# EasyEDA Pro project BLDC Motor Controller PCB.eprj

# Schematic Schematic1
Board Name: Board1; Create Date: 2024-09-17
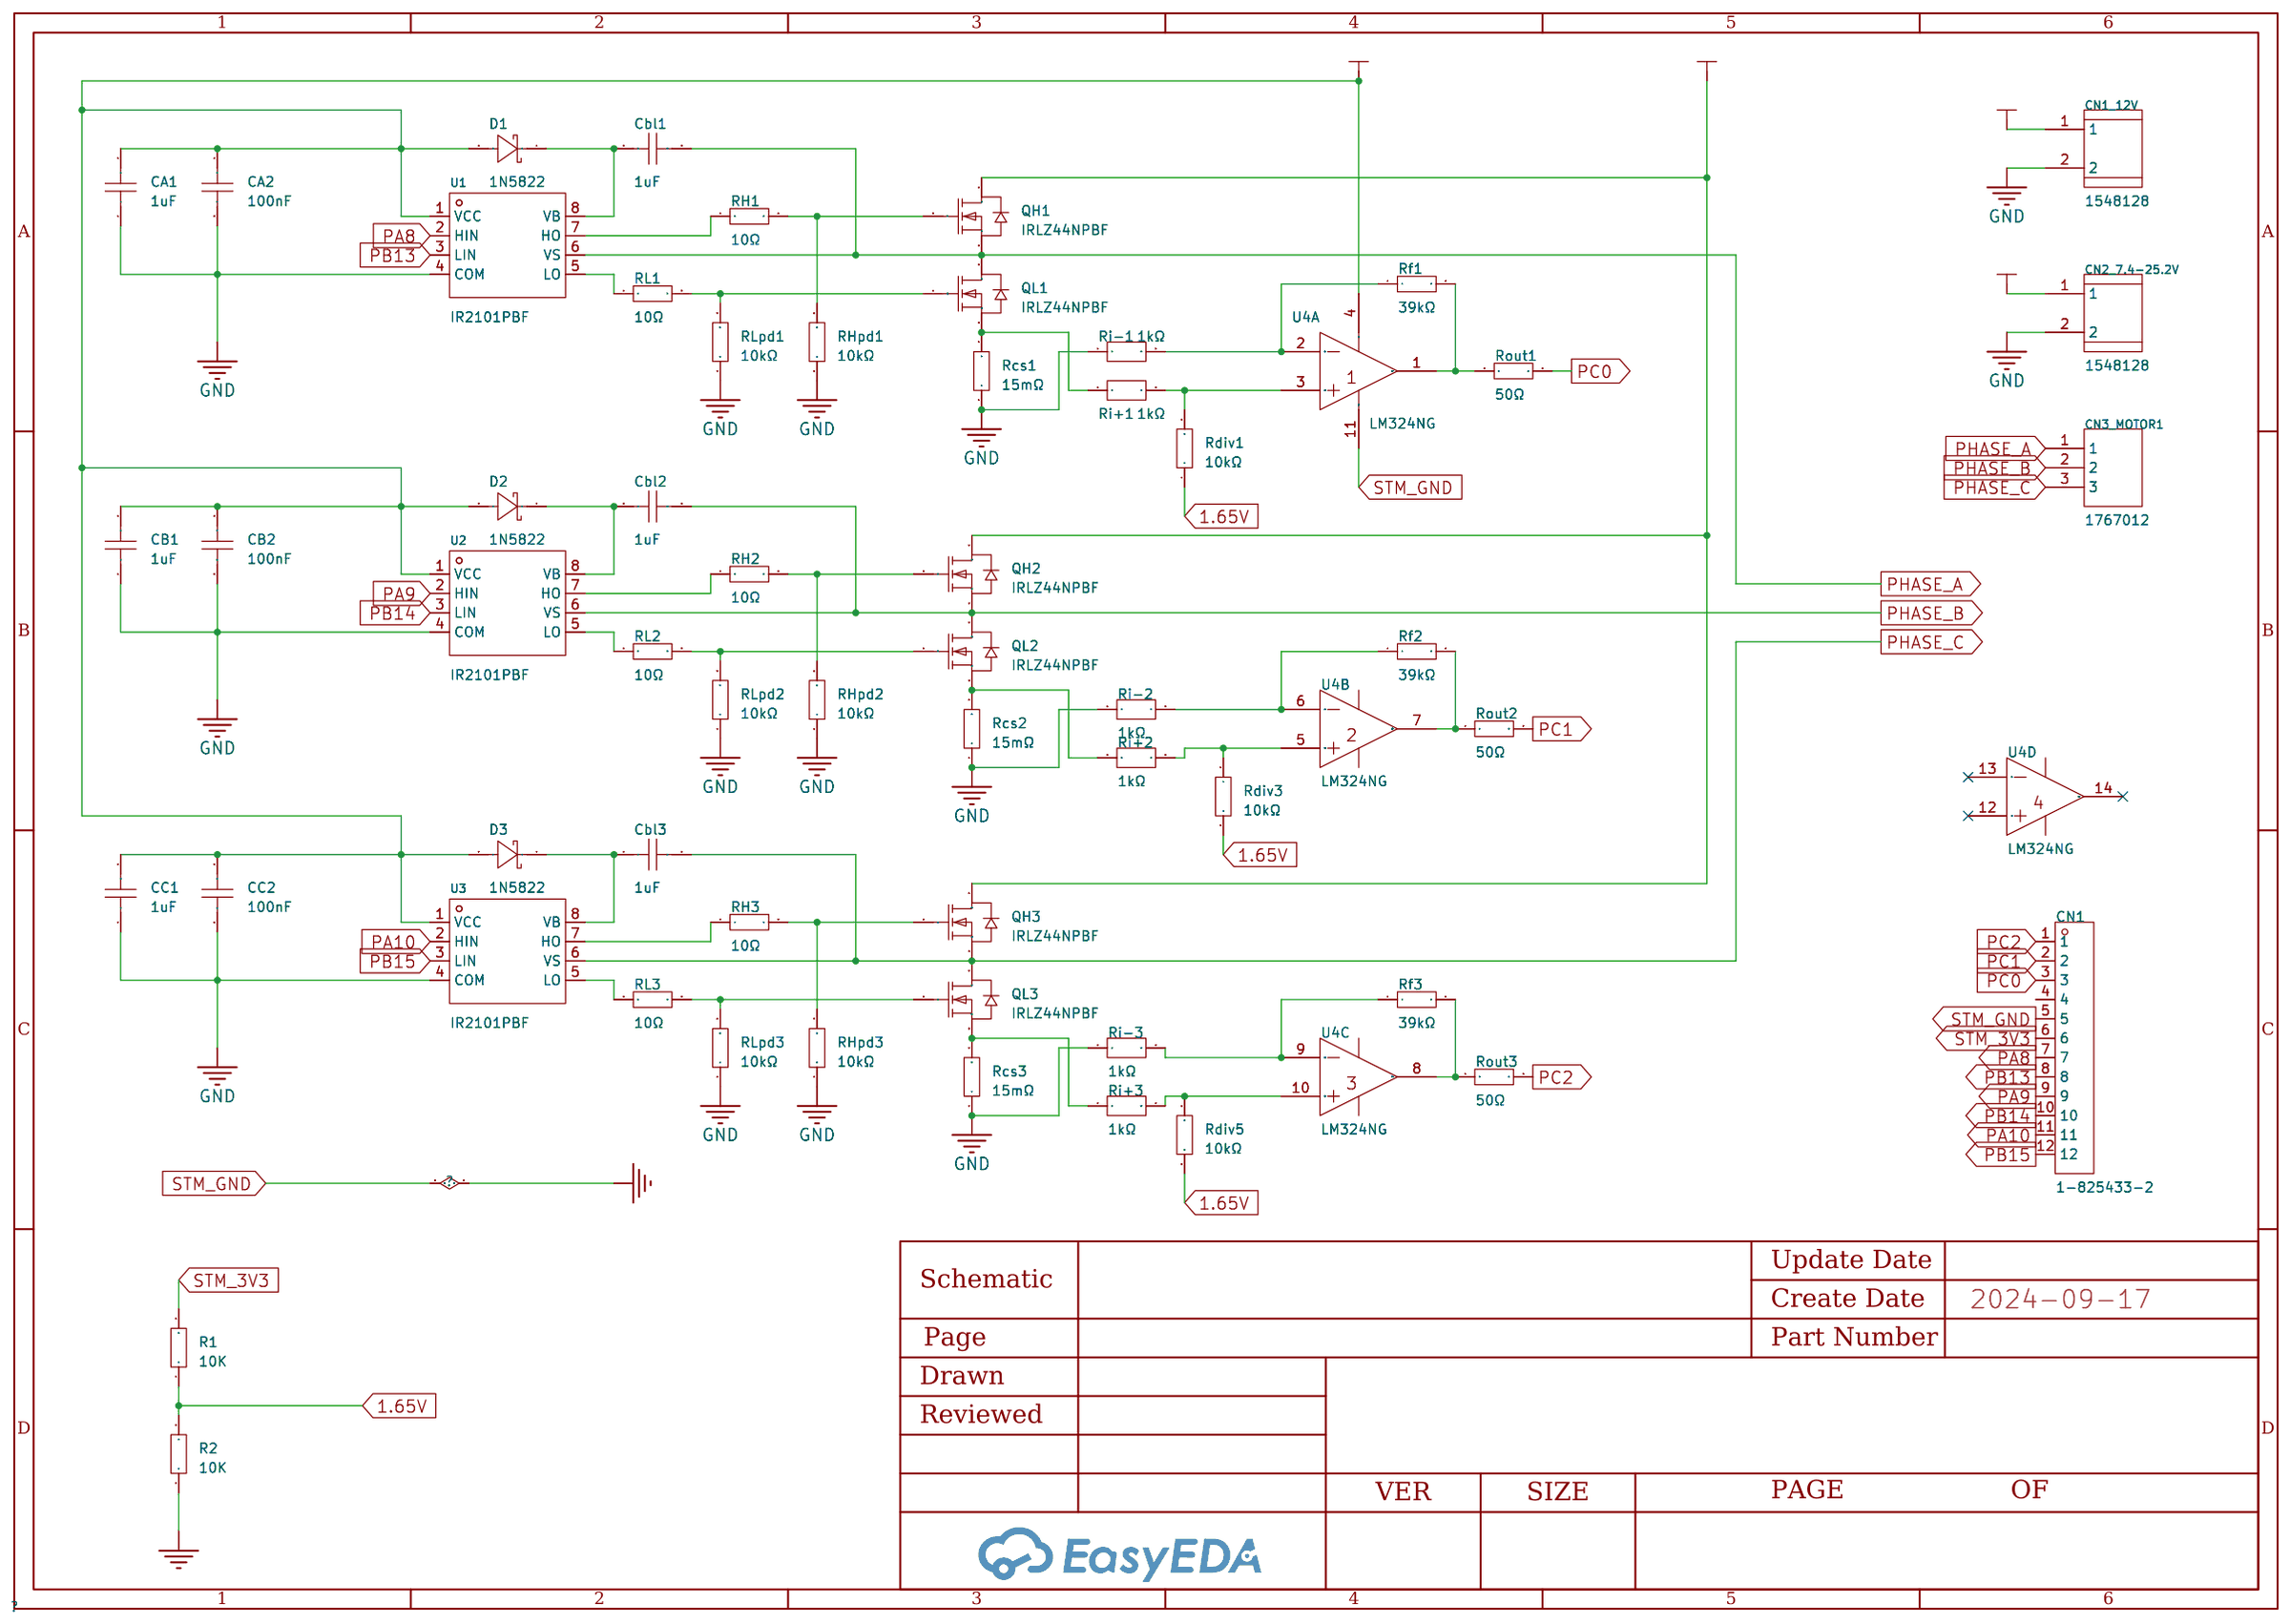
[diagram p0: schematic sheet]

## Parts
CA1  1uF  [CAP-TH_BD2.5-L6.6-P9.00-D0.50]
CA2  100nF  [CAP-TH_L3.8-W2.5-P5.08-D0.50]
CB1  1uF  [CAP-TH_BD2.5-L6.6-P9.00-D0.50]
CB2  100nF  [CAP-TH_L3.8-W2.5-P5.08-D0.50]
Cbl1  1uF  [CAP-TH_BD2.5-L6.6-P9.00-D0.50]
Cbl2  1uF  [CAP-TH_BD2.5-L6.6-P9.00-D0.50]
Cbl3  1uF  [CAP-TH_BD2.5-L6.6-P9.00-D0.50]
CC1  1uF  [CAP-TH_BD2.5-L6.6-P9.00-D0.50]
CC2  100nF  [CAP-TH_L3.8-W2.5-P5.08-D0.50]
CN1  1-825433-2  [HDR-TH_12P-P2.54-V-M]
CN1_12V  1548128  [CONN-TH_2P-P5.08_1733570]
CN2_7.4-25.2V  1548128  [CONN-TH_2P-P5.08_1733570]
CN3_MOTOR1  1767012  [CONN-TH_3P-P7.62_1717732]
D1  1N5822  [DO-201AD_BD5.3-L9.5-P13.50-D1.4-RD]
D2  1N5822  [DO-201AD_BD5.3-L9.5-P13.50-D1.4-RD]
D3  1N5822  [DO-201AD_BD5.3-L9.5-P13.50-D1.4-RD]
QH1  IRLZ44NPBF  [TO-220-3_L10.0-W4.5-P2.54-T]
QH2  IRLZ44NPBF  [TO-220-3_L10.0-W4.5-P2.54-T]
QH3  IRLZ44NPBF  [TO-220-3_L10.0-W4.5-P2.54-T]
QL1  IRLZ44NPBF  [TO-220-3_L10.0-W4.5-P2.54-T]
QL2  IRLZ44NPBF  [TO-220-3_L10.0-W4.5-P2.54-T]
QL3  IRLZ44NPBF  [TO-220-3_L10.0-W4.5-P2.54-T]
R1  10K  [R0603]
R2  10K  [R0603]
Rcs1  15mΩ  [R1206]
Rcs2  15mΩ  [R1206]
Rcs3  15mΩ  [R1206]
Rdiv1  10kΩ  [RES-TH_BD2.2-L6.5-P10.50-D0.6]
Rdiv3  10kΩ  [RES-TH_BD2.2-L6.5-P10.50-D0.6]
Rdiv5  10kΩ  [RES-TH_BD2.2-L6.5-P10.50-D0.6]
Rf1  39kΩ  [RES-TH_BD2.2-L6.5-P10.50-D0.6]
Rf2  39kΩ  [RES-TH_BD2.2-L6.5-P10.50-D0.6]
Rf3  39kΩ  [RES-TH_BD2.2-L6.5-P10.50-D0.6]
RH1  10Ω  [RES-TH_BD2.2-L6.5-P10.50-D0.6]
RH2  10Ω  [RES-TH_BD2.2-L6.5-P10.50-D0.6]
RH3  10Ω  [RES-TH_BD2.2-L6.5-P10.50-D0.6]
RHpd1  10kΩ  [RES-TH_BD2.2-L6.5-P10.50-D0.6]
RHpd2  10kΩ  [RES-TH_BD2.2-L6.5-P10.50-D0.6]
RHpd3  10kΩ  [RES-TH_BD2.2-L6.5-P10.50-D0.6]
Ri+1  1kΩ  [RES-TH_BD2.4-L6.3-P10.30-D0.6]
Ri+2  1kΩ  [RES-TH_BD2.4-L6.3-P10.30-D0.6]
Ri+3  1kΩ  [RES-TH_BD2.4-L6.3-P10.30-D0.6]
Ri-1  1kΩ  [RES-TH_BD2.4-L6.3-P10.30-D0.6]
Ri-2  1kΩ  [RES-TH_BD2.4-L6.3-P10.30-D0.6]
Ri-3  1kΩ  [RES-TH_BD2.4-L6.3-P10.30-D0.6]
RL1  10Ω  [RES-TH_BD2.2-L6.5-P10.50-D0.6]
RL2  10Ω  [RES-TH_BD2.2-L6.5-P10.50-D0.6]
RL3  10Ω  [RES-TH_BD2.2-L6.5-P10.50-D0.6]
RLpd1  10kΩ  [RES-TH_BD2.2-L6.5-P10.50-D0.6]
RLpd2  10kΩ  [RES-TH_BD2.2-L6.5-P10.50-D0.6]
RLpd3  10kΩ  [RES-TH_BD2.2-L6.5-P10.50-D0.6]
Rout1  50Ω  [RES-TH_BD2.2-L6.5-P10.50-D0.6]
Rout2  50Ω  [RES-TH_BD2.2-L6.5-P10.50-D0.6]
Rout3  50Ω  [RES-TH_BD2.2-L6.5-P10.50-D0.6]
U1  IR2101PBF  [DIP-8_L9.9-W6.6-P2.54-LS7.62-BL]
U2  IR2101PBF  [DIP-8_L9.9-W6.6-P2.54-LS7.62-BL]
U3  IR2101PBF  [DIP-8_L9.9-W6.6-P2.54-LS7.62-BL]
U4  LM324NG  [PDIP-14_L19.7-W6.6-P2.54-LS8.3-BL]  (sections 1,2,3,4)

## Library data of the parts
CA1 CB1 Cbl1-Cbl3 CC1 = SA205C303JAR: Capacitance:0.03uF Tolerance:±5% Tolerance:±5% Voltage Rated: Temperature Coefficient:; LCSC Part Name: 30nF ±5% 50V; Supplier Part: C2281278; Manufacturer: Kyocera AVX; Supplier Footprint: 插件,D2.5xL6.6mm; JLCPCB Part Class: Extended Part; Datasheet: https://atta.szlcsc.com/upload/public/pdf/source/20221018/3D1EC8610533FE1C26161EB1B75339DB.pdf; Supplier: LCSC; Tolerance: ±5%
CA2 CB2 CC2 = A104K15X7RF5UAA: Capacitance:0.1uF Tolerance:±10% Tolerance:±10% Voltage Rated: Temperature Coefficient:; LCSC Part Name: 100nF ±10% 50V; Supplier Part: C1620057; Manufacturer: VISHAY(威世); Supplier Footprint: 插件,D2.5xL3.8mm; JLCPCB Part Class: Extended Part; Datasheet: https://atta.szlcsc.com/upload/public/pdf/source/20210630/2D198A6344B58DDF852CFB19135430C4.pdf; Supplier: LCSC; Tolerance: ±10%
CN1 = HB-PH3-254112PB2GOP: Pin Structure:1x12P Pitch:2.54mm Row Spacing:2.54mm Circluar Pins/Square Pins:Square Pins Mounting Type:Straight Number of Rows:Plugin Number of Pins:12P Current Rating (Max):3A Voltage Rating (Max):250V Length of Mating Pin:6mm Insulation Height:2.54mm L; LCSC Part Name: 间距:2.54mm 1x12P 直插 方针; Supplier Part: C6332195; Manufacturer: HANBO(汉博); Supplier Footprint: 插件,P=2.54mm; JLCPCB Part Class: Extended Part; Datasheet: https://atta.szlcsc.com/upload/public/pdf/source/20230803/F72D259687963761DF1B552F3BB84A31.pdf; Supplier: LCSC; Pin Structure: 1x12P; Pitch: 2.54mm; Row Spacing: 2.54mm; Circluar Pins/Square Pins: Square Pins; Mounting Type: Straight; Number of Rows: Plugin; Number of Pins: 12P; Current Rating (Max): 3A; Voltage Rating (Max): 250V; Length of Mating Pin: 6mm; Insulation Height: 2.54mm; Length of End Connection Pin: 3mm; Contact Plating: Gold; Operating Temperature Range: -40℃~+105℃; Soldering Temperature(Max): 260℃; Color: Black
CN1_12V CN2_7.4-25.2V = 1733570: Structure:1x2P Pitch:5.08mm Color:Green Mounting Style:Straight Current Rating (Max):17.5A Voltage Rating (Max):400V Number of Pins:2P Number of Rows:1 Wire Gauge - AWG:14~30 Wire Gauge - AWG:14~30 Number of PINs Per Row:2 Operating Temperature Range:- Op; LCSC Part Name: 5.08mm 1x2P 排数:1 每排P数:2 直插; Supplier Part: C92150; Manufacturer: Phoenix Contact(菲尼克斯); Supplier Footprint: 插件,P=5.08mm; JLCPCB Part Class: Extended Part; Datasheet: https://atta.szlcsc.com/upload/public/pdf/source/20170105/1483610785418.pdf; Supplier: LCSC; Structure: 1x2P; Pitch: 5.08mm; Color: Green; Mounting Style: Straight; Current Rating (Max): 17.5A; Voltage Rating (Max): 400V; Number of Pins: 2P; Number of Rows: 1; Wire Gauge - AWG: 14~30; Number of PINs Per Row: 2
CN3_MOTOR1 = 1717732: Structure:1x3P Pitch:7.62mm Color:Green Mounting Style:Straight Current Rating (Max):17.5A Voltage Rating (Max):630V Number of Pins:3P Number of Rows:1 Wire Gauge - AWG:14~30 Wire Gauge - AWG:14~30 Number of PINs Per Row:3 Operating Temperature Range:- Op; LCSC Part Name: 7.62mm 1x3P 排数:1 每排P数:3 直插; Supplier Part: C90080; Manufacturer: Phoenix Contact(菲尼克斯); Supplier Footprint: 插件,P=7.62mm; JLCPCB Part Class: Extended Part; Datasheet: https://atta.szlcsc.com/upload/public/pdf/source/20161209/1481271801347.pdf; Supplier: LCSC; Structure: 1x3P; Pitch: 7.62mm; Color: Green; Mounting Style: Straight; Current Rating (Max): 17.5A; Voltage Rating (Max): 630V; Number of Pins: 3P; Number of Rows: 1; Wire Gauge - AWG: 14~30; Number of PINs Per Row: 3
D1-D3 = 1N5822_C915962: Diode Configuration:- Forward Voltage (Vf@If):525mV@3A Reverse Voltage (Vr):40V Average Rectified Current (Io):3A Reverse Leakage Current (Ir):2mA@40V; LCSC Part Name: 电压:40V 电流:3A; Supplier Part: C915962; Manufacturer: ST(意法半导体); Supplier Footprint: DO-201AD; JLCPCB Part Class: Extended Part; Datasheet: https://atta.szlcsc.com/upload/public/pdf/source/20210820/95C5062786EAC70E2238E3EBE6005F95.pdf; Supplier: LCSC; Forward Voltage (Vf@If): 525mV@3A; Reverse Voltage (Vr): 40V; Average Rectified Current (Io): 3A; Reverse Leakage Current (Ir): 2mA@40V
QH1-QH3 QL1-QL3 = IRLZ44NPBF: Type:1个NChannel Drain Source Voltage (Vdss): Continuous Drain Current (Id): Power Dissipation (Pd):； Drain Source On Resistance (RDS(on)@Vgs,Id):22mΩ@10V,25A Gate Threshold Voltage (Vgs(th)@Id):2V@250uA Total Gate Charge (Qg@Vgs):48nC@5V Input Capacitance; LCSC Part Name: 1个N沟道 耐压:55V 电流:47A; Supplier Part: C38774; Manufacturer: Infineon(英飞凌); Supplier Footprint: TO-220AB; JLCPCB Part Class: Extended Part; Datasheet: https://atta.szlcsc.com/upload/public/pdf/source/20141125/1457707250505.pdf; Supplier: LCSC; Type: 1个NChannel; Power Dissipation (Pd): ；; Drain Source On Resistance (RDS(on)@Vgs,Id): 22mΩ@10V,25A; Gate Threshold Voltage (Vgs(th)@Id): 2V@250uA; Total Gate Charge (Qg@Vgs): 48nC@5V; Input Capacitance (Ciss@Vds): 1.7nF@25V; Operating Temperature: -55℃~+175℃@(Tj)
R1 R2 = Res_0603: Supplier Footprint: 0603
Rcs1-Rcs3 = WSL1206R0150FEA: Type: Resistance:15mΩ Tolerance:±1% Tolerance:±1% Power(Watts):250mW Temperature Coefficient:±75ppm/℃ Temperature Coefficient:±75ppm/℃ Operating Temperature Range:-65℃~+170℃ Operating Temperature Range:-65℃~+170℃; LCSC Part Name: 15mΩ ±1% 250mW; Supplier Part: C844483; Manufacturer: VISHAY(威世); Supplier Footprint: 1206; JLCPCB Part Class: Extended Part; Datasheet: https://atta.szlcsc.com/upload/public/pdf/source/20221018/05BC82F48F277CEB4404A331124EE98E.pdf; Supplier: LCSC; Tolerance: ±1%; Power(Watts): 250mW; Temperature Coefficient: ±75ppm/℃; Operating Temperature Range: -65℃~+170℃
Rdiv1 Rdiv3 Rdiv5 Rf1-Rf3 RH1-RH3 RHpd1-RHpd3 RL1-RL3 RLpd1-RLpd3 Rout1-Rout3 = MFR-25FTE52-39K: Type:Metal Film Resistors Resistance: Tolerance:±1% Tolerance:±1% Power(Watts):250mW Temperature Coefficient:±50ppm/℃ Temperature Coefficient:±50ppm/℃ Operating Temperature Range:-55℃~+155℃ Operating Temperature Range:-55℃~+155℃; LCSC Part Name: 金属膜电阻 39kΩ ±1% 250mW; Supplier Part: C173011; Manufacturer: YAGEO(国巨); Supplier Footprint: 插件,D2.4xL6.3mm; JLCPCB Part Class: Extended Part; Datasheet: https://atta.szlcsc.com/upload/public/pdf/source/20191118/C457825_18355E864DE4965678DC27B0EBC3E21E.pdf; Supplier: LCSC; Type: Metal Film Resistors; Tolerance: ±1%; Power(Watts): 250mW; Temperature Coefficient: ±50ppm/℃; Operating Temperature Range: -55℃~+155℃
Ri+1-Ri+3 Ri-1-Ri-3 = MFR-25FRF52-1K: Type:Metal Film Resistors Resistance: Tolerance:±1% Tolerance:±1% Power(Watts):250mW Temperature Coefficient:±100ppm/℃ Temperature Coefficient:±100ppm/℃ Operating Temperature Range:-55℃~+155℃ Operating Temperature Range:-55℃~+155℃; LCSC Part Name: 金属膜电阻 1kΩ ±1% 250mW; Supplier Part: C3424075; Manufacturer: YAGEO(国巨); Supplier Footprint: 插件,D2.4xL6.3mm; JLCPCB Part Class: Extended Part; Datasheet: https://atta.szlcsc.com/upload/public/pdf/source/20231121/B79DF093C3343C1C7D20BECE94D94E07.pdf; Supplier: LCSC; Type: Metal Film Resistors; Tolerance: ±1%; Power(Watts): 250mW; Temperature Coefficient: ±100ppm/℃; Operating Temperature Range: -55℃~+155℃
U1-U3 = IR2101PBF: Driven Configuration:Half Bridge Load Type:MOSFET；IGBT Number of Drivers:2 Peak Output Current(sink):360mA Peak Output Current(source):210mA Supply Voltage:10V~20V Supply Voltage:10V~20V Rise Time:100ns Fall Time:50ns Operating Temperature:-40℃~+150℃@(Tj); Supplier Part: C2955; Manufacturer: Infineon(英飞凌); Supplier Footprint: PDIP-8; JLCPCB Part Class: Extended Part; Datasheet: https://atta.szlcsc.com/upload/public/pdf/source/20180112/C152687_15157257779631261587.pdf; Supplier: LCSC; Driven Configuration: Half Bridge; Load Type: MOSFET；IGBT; Number of Drivers: 2; Peak Output Current(sink): 360mA; Peak Output Current(source): 210mA; Supply Voltage: 10V~20V; Rise Time: 100ns; Fall Time: 50ns; Operating Temperature: -40℃~+150℃@(Tj)
U4 = LM324NG: Number of Circuits:Quad Gain Bandwidth Product(GBP):1MHz Slew Rate(SR):0.6V/us Supply Current:1.4mA; LCSC Part Name: 停产; Supplier Part: C99121; Manufacturer: onsemi(安森美); Supplier Footprint: PDIP-14; JLCPCB Part Class: Extended Part; Datasheet: https://atta.szlcsc.com/upload/public/pdf/source/20170330/1490854840702.pdf; Supplier: LCSC; Number of Circuits: Quad; Gain Bandwidth Product(GBP): 1MHz; Slew Rate(SR): 0.6V/us; Supply Current: 1.4mA

## Nets
1.65V: R1.1 R2.2 Rdiv1.1 Rdiv3.2 Rdiv5.2
GND: CA1.1 CA2.2 CB1.1 CB2.2 CC1.1 CC2.2 CN1.5 CN1_12V.2 CN2_7.4-25.2V.2 R2.1 Rcs1.1 Rcs2.1 Rcs3.1 RHpd1.1 RHpd2.1 RHpd3.1 Ri-1.1 Ri-2.1 Ri-3.1 RLpd1.1 RLpd2.1 RLpd3.1 U1.4(COM) U2.4(COM) U3.4(COM) U4.11(GND)
VCC_7.4V-25.2V: CN2_7.4-25.2V.1 QH1.2(D) QH2.2(D) QH3.2(D)
VCC_12V: CA1.2 CA2.1 CB1.2 CB2.1 CC1.2 CC2.1 CN1_12V.1 D1.2(A) D2.2(A) D3.2(A) U1.1(VCC) U2.1(VCC) U3.1(VCC) U4.4(VCC)
PA8: CN1.7 U1.2(HIN)
PA9: CN1.9 U2.2(HIN)
PA10: CN1.11 U3.2(HIN)
PB13: CN1.8 U1.3(LIN)
PB14: CN1.10 U2.3(LIN)
PB15: CN1.12 U3.3(LIN)
PC0: CN1.3 Rout1.2
PC1: CN1.2 Rout2.2
PC2: CN1.1 Rout3.2
PHASE_A: Cbl1.2 CN3_MOTOR1.1 QH1.3(S) QL1.2(D) U1.6(VS)
PHASE_B: Cbl2.2 CN3_MOTOR1.2 QH2.3(S) QL2.2(D) U2.6(VS)
PHASE_C: Cbl3.2 CN3_MOTOR1.3 QH3.3(S) QL3.2(D) U3.6(VS)
STM_3V3: CN1.6 R1.2
$1N901: RH1.1 U1.7(HO)
$1N905: RL1.1 U1.5(LO)
$1N1407: QH1.1(G) RH1.2 RHpd1.2
$1N1412: QL1.1(G) RL1.2 RLpd1.2
$1N2797: Cbl1.1 D1.1(K) U1.8(VB)
$1N3429: RH2.1 U2.7(HO)
$1N3432: RL2.1 U2.5(LO)
$1N3435: QH2.1(G) RH2.2 RHpd2.2
$1N3439: QL2.1(G) RL2.2 RLpd2.2
$1N3456: Cbl2.1 D2.1(K) U2.8(VB)
$1N3955: RH3.1 U3.7(HO)
$1N3958: RL3.1 U3.5(LO)
$1N3961: QH3.1(G) RH3.2 RHpd3.2
$1N3965: QL3.1(G) RL3.2 RLpd3.2
$1N3982: Cbl3.1 D3.1(K) U3.8(VB)
$1N9537: Rf1.1 Ri-1.2 U4.2(IN1-)
$1N9581: Rf2.1 Ri-2.2 U4.6(IN2-)
$1N9815: Rf3.1 Ri-3.2 U4.9(IN3-)
$1N9932: Rdiv1.2 Ri+1.2 U4.3(IN1+)
$1N9983: Rdiv3.1 Ri+2.2 U4.5(IN2+)
$1N9988: QL2.3(S) Rcs2.2 Ri+2.1
$1N10075: Rdiv5.1 Ri+3.2 U4.10(IN3+)
$1N10080: QL3.3(S) Rcs3.2 Ri+3.1
$1N10124: Rf1.2 Rout1.1 U4.1(OUT1)
$1N10167: Rf2.2 Rout2.1 U4.7(OUT2)
$1N10257: Rf3.2 Rout3.1 U4.8(OUT3)
$1N11031: QL1.3(S) Rcs1.2 Ri+1.1

Not connected (* = marked no-connect by the designer): CN1 4; U4 12(IN4+)* 13(IN4-)* 14(OUT4)*

# Board PCB1
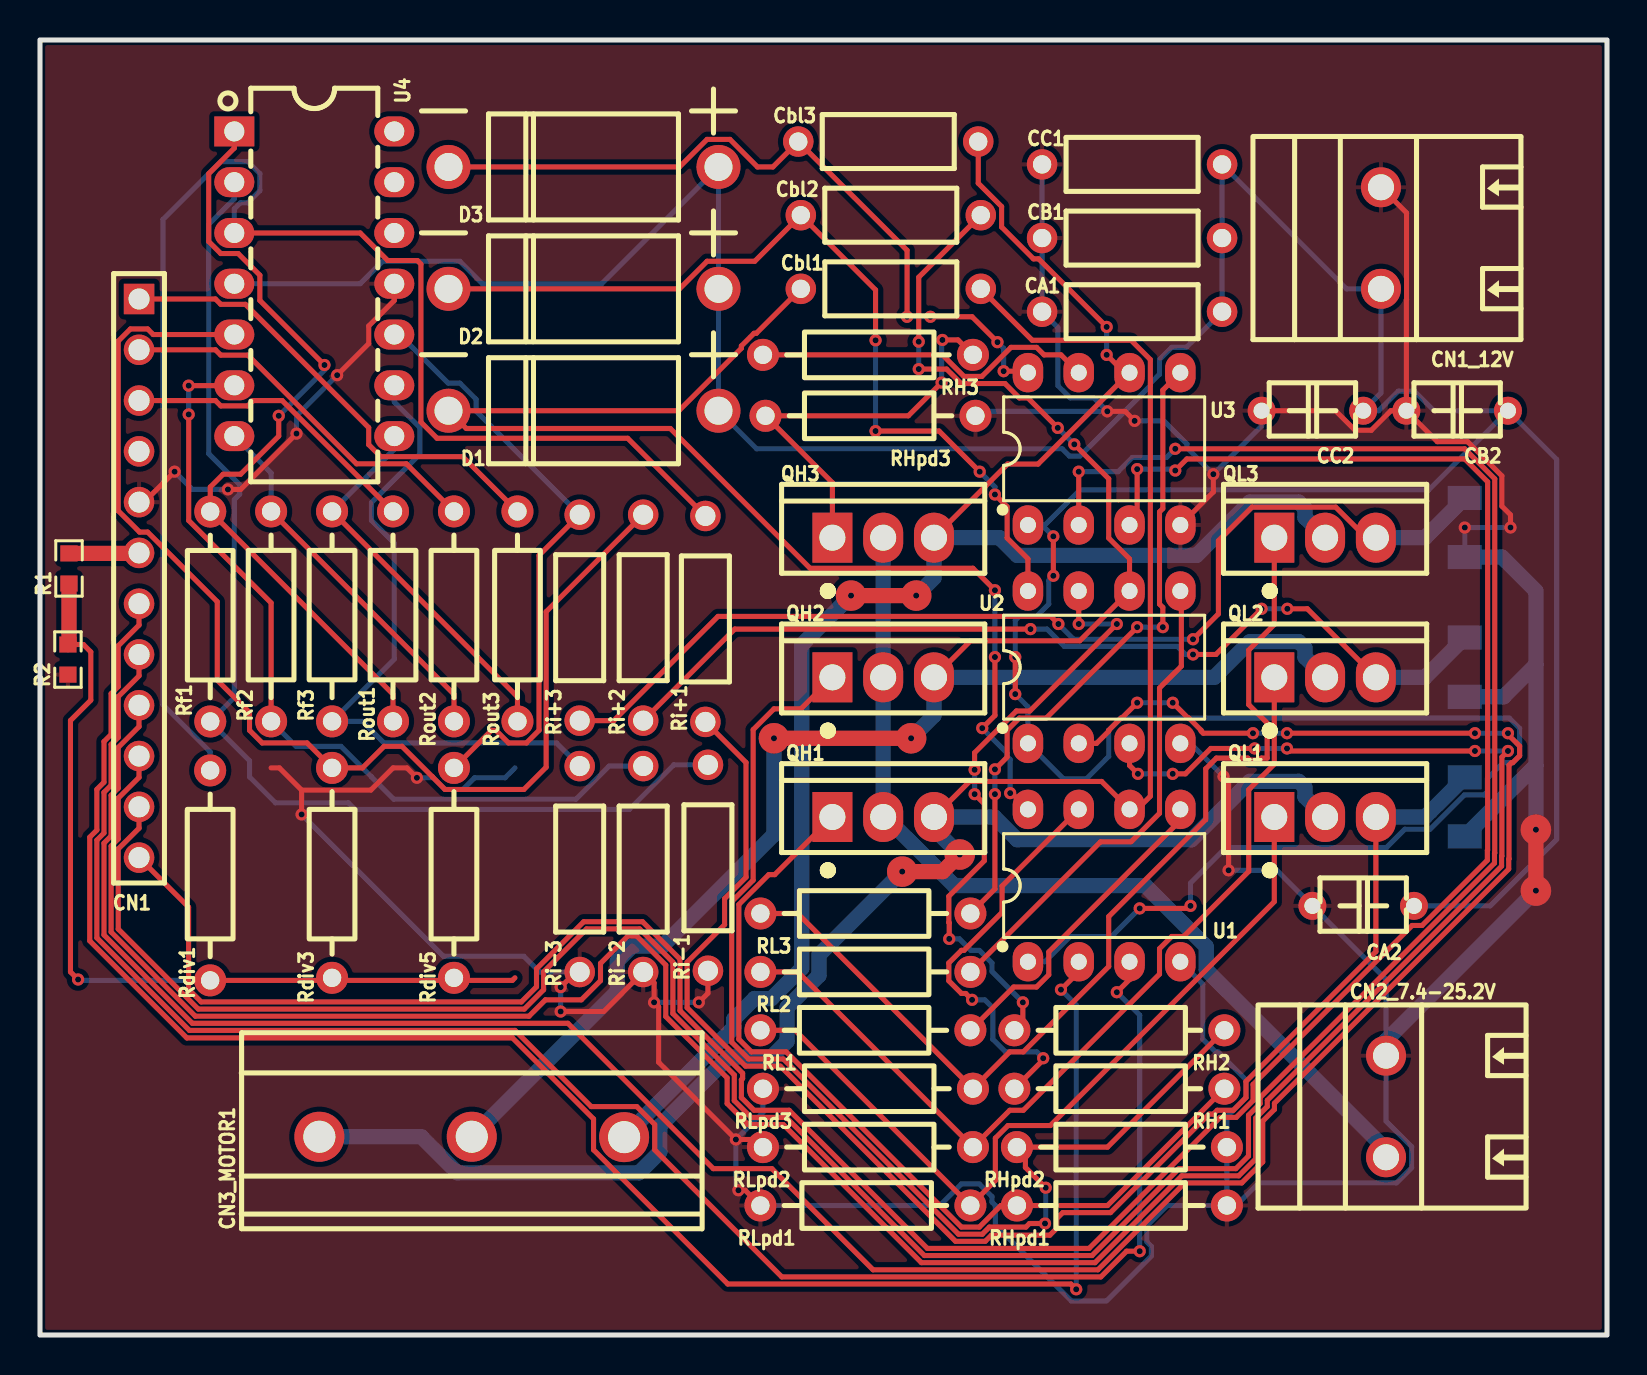
[diagram p1: board, top side]
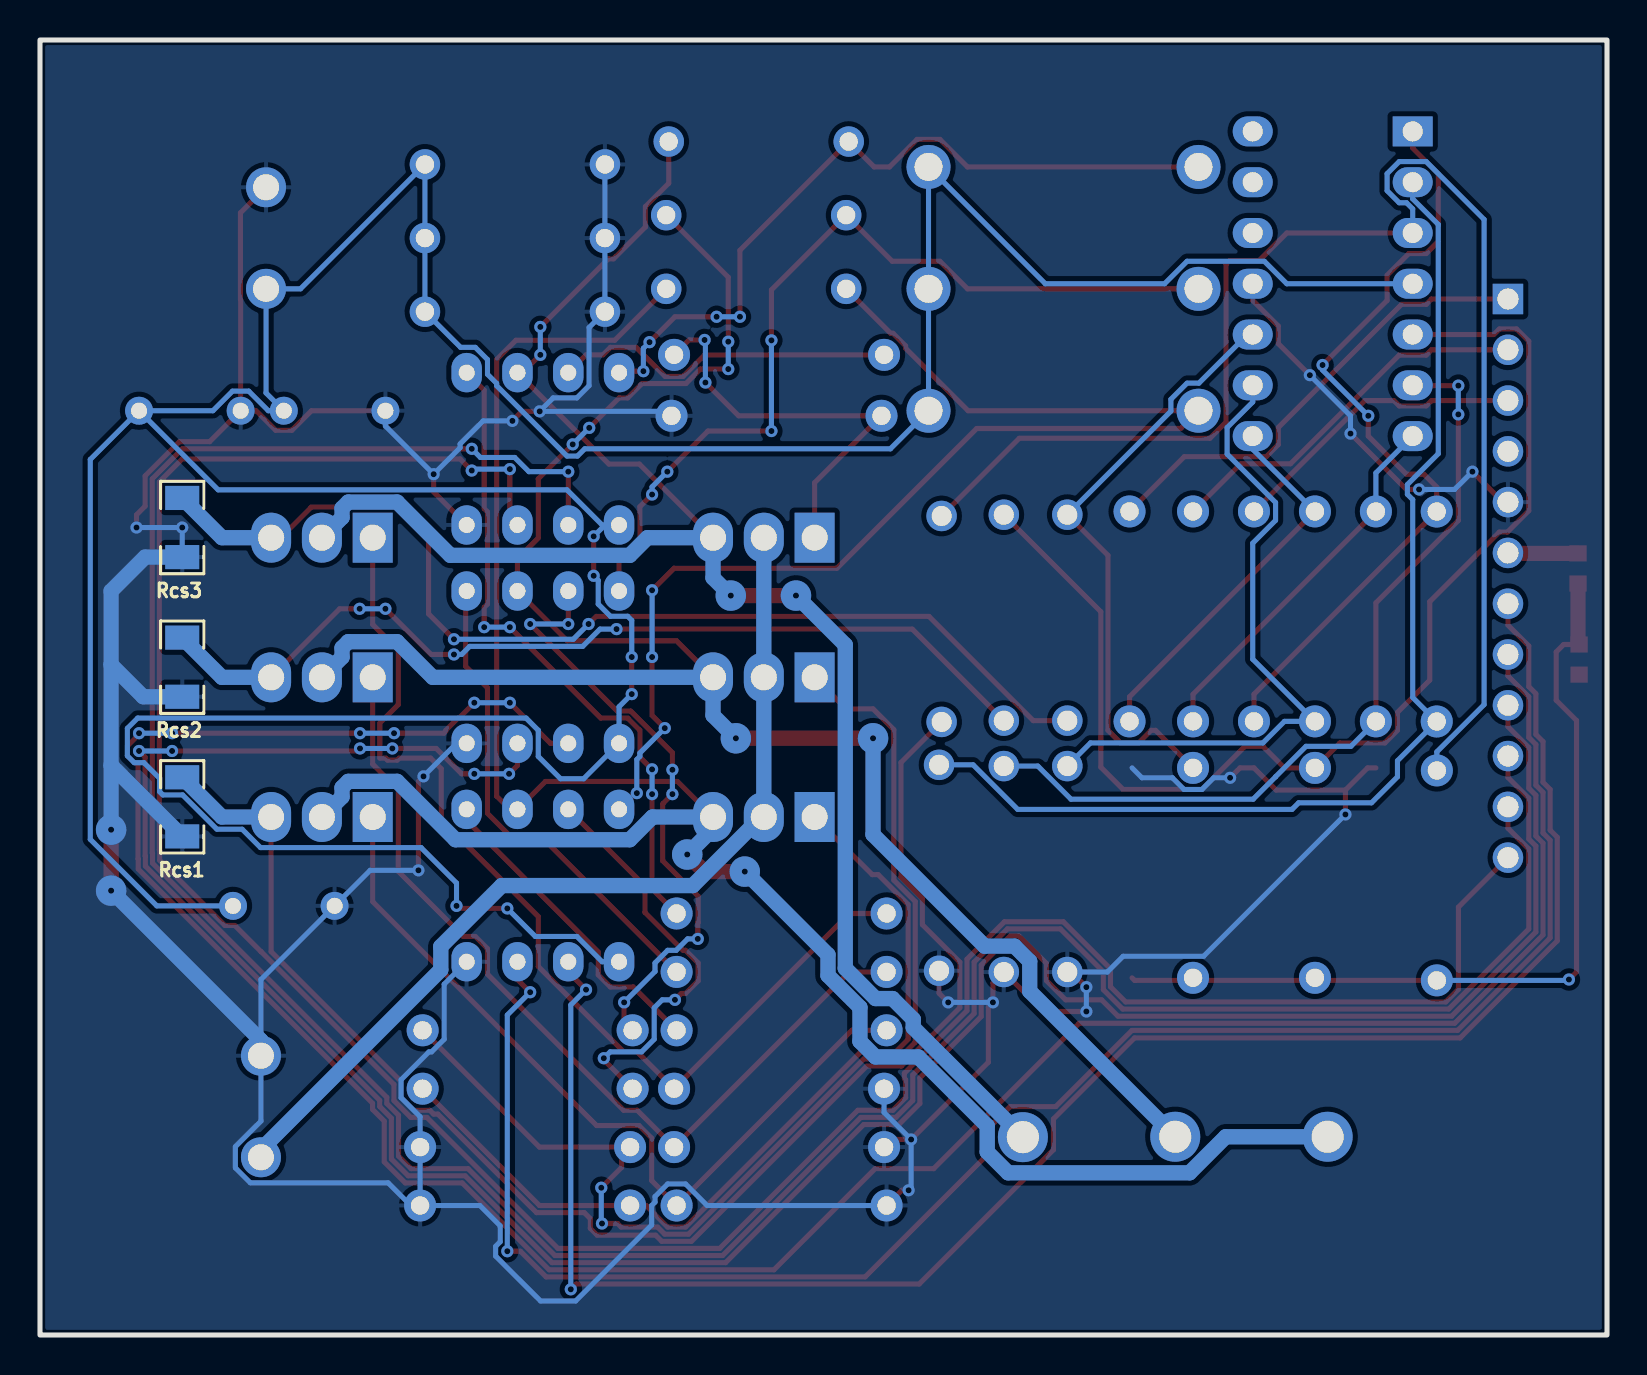
[diagram p2: board, bottom side, seen from below]

Outline 78.36 x 64.77 mm; copper layers: Top Layer, Bottom Layer. Coordinates in mm from the lower left corner of the outline.
Outline path: rectangle 0,64.77 78.36,0
Stack: Top Layer 0.035mm / Dielectric1 1.51mm FR4 er 4.5 / Bottom Layer 0.035mm

## Design rules (mm)
template: JLCPCB Capability(Two Layers Board)
spacing copperThickness1oz (default): track to track 0.102, other pairs 0.152 to 0.3
spacing copperThickness2oz: track to track 0.203, other pairs 0.152 to 0.3
track width copperThickness1oz (default): min 0.127, default 0.254, max 2.54
track width copperThickness2oz: min 0.203, default 0.254, max 2.54
differential pair differentialPair (default): width min 0.127, default 0.254, max 2.54; gap min 0.152, default 0.152
via viaSize (default): diameter min 0.5, default 0.61, max 10; hole min 0.3, default 0.305, max 6.3

## Placement (name value [footprint] x y rotation side)
CA1  1uF  [CAP-TH_BD2.5-L6.6-P9.00-D0.50]  54.61 51.18 0 top
CA2  100nF  [CAP-TH_L3.8-W2.5-P5.08-D0.50]  66.17 21.46 180 top
CB1  1uF  [CAP-TH_BD2.5-L6.6-P9.00-D0.50]  54.61 54.86 0 top
CB2  100nF  [CAP-TH_L3.8-W2.5-P5.08-D0.50]  70.87 46.23 180 top
Cbl1  1uF  [CAP-TH_BD2.5-L6.6-P9.00-D0.50]  42.55 52.32 0 top
Cbl2  1uF  [CAP-TH_BD2.5-L6.6-P9.00-D0.50]  42.55 56.01 0 top
Cbl3  1uF  [CAP-TH_BD2.5-L6.6-P9.00-D0.50]  42.42 59.69 0 top
CC1  1uF  [CAP-TH_BD2.5-L6.6-P9.00-D0.50]  54.61 58.55 0 top
CC2  100nF  [CAP-TH_L3.8-W2.5-P5.08-D0.50]  63.63 46.23 180 top
CN1  1-825433-2  [HDR-TH_12P-P2.54-V-M]  4.95 37.85 270 top
CN1_12V  1548128  [CONN-TH_2P-P5.08_1733570]  67.06 54.86 90 top
CN2_7.4-25.2V  1548128  [CONN-TH_2P-P5.08_1733570]  67.31 11.43 90 top
CN3_MOTOR1  1767012  [CONN-TH_3P-P7.62_1717732]  21.59 9.91 0 top
D1  1N5822  [DO-201AD_BD5.3-L9.5-P13.50-D1.4-RD]  27.18 46.23 0 top
D2  1N5822  [DO-201AD_BD5.3-L9.5-P13.50-D1.4-RD]  27.18 52.32 0 top
D3  1N5822  [DO-201AD_BD5.3-L9.5-P13.50-D1.4-RD]  27.18 58.42 0 top
QH1  IRLZ44NPBF  [TO-220-3_L10.0-W4.5-P2.54-T]  42.16 25.91 90 top
QH2  IRLZ44NPBF  [TO-220-3_L10.0-W4.5-P2.54-T]  42.16 32.89 90 top
QH3  IRLZ44NPBF  [TO-220-3_L10.0-W4.5-P2.54-T]  42.16 39.88 90 top
QL1  IRLZ44NPBF  [TO-220-3_L10.0-W4.5-P2.54-T]  64.26 25.91 90 top
QL2  IRLZ44NPBF  [TO-220-3_L10.0-W4.5-P2.54-T]  64.26 32.89 90 top
QL3  IRLZ44NPBF  [TO-220-3_L10.0-W4.5-P2.54-T]  64.26 39.88 90 top
R1  10K  [R0603]  1.45 38.34 90 top
R2  10K  [R0603]  1.4 33.78 90 top
Rcs1  15mΩ  [R1206]  71.25 26.42 90 bottom
Rcs2  15mΩ  [R1206]  71.25 33.4 90 bottom
Rcs3  15mΩ  [R1206]  71.25 40.39 90 bottom
Rdiv1  10kΩ  [RES-TH_BD2.2-L6.5-P10.50-D0.6]  8.51 22.99 90 top
Rdiv3  10kΩ  [RES-TH_BD2.2-L6.5-P10.50-D0.6]  14.61 23.11 270 top
Rdiv5  10kΩ  [RES-TH_BD2.2-L6.5-P10.50-D0.6]  20.7 23.11 270 top
Rf1  39kΩ  [RES-TH_BD2.2-L6.5-P10.50-D0.6]  8.51 35.94 90 top
Rf2  39kΩ  [RES-TH_BD2.2-L6.5-P10.50-D0.6]  11.56 35.94 90 top
Rf3  39kΩ  [RES-TH_BD2.2-L6.5-P10.50-D0.6]  14.61 35.94 90 top
RH1  10Ω  [RES-TH_BD2.2-L6.5-P10.50-D0.6]  53.98 12.32 0 top
RH2  10Ω  [RES-TH_BD2.2-L6.5-P10.50-D0.6]  53.98 15.24 0 top
RH3  10Ω  [RES-TH_BD2.2-L6.5-P10.50-D0.6]  41.4 49.02 0 top
RHpd1  10kΩ  [RES-TH_BD2.2-L6.5-P10.50-D0.6]  54.1 6.48 180 top
RHpd2  10kΩ  [RES-TH_BD2.2-L6.5-P10.50-D0.6]  54.1 9.4 180 top
RHpd3  10kΩ  [RES-TH_BD2.2-L6.5-P10.50-D0.6]  41.53 45.97 180 top
Ri+1  1kΩ  [RES-TH_BD2.4-L6.3-P10.30-D0.6]  33.27 35.81 90 top
Ri+2  1kΩ  [RES-TH_BD2.4-L6.3-P10.30-D0.6]  30.16 35.88 90 top
Ri+3  1kΩ  [RES-TH_BD2.4-L6.3-P10.30-D0.6]  26.99 35.88 90 top
Ri-1  1kΩ  [RES-TH_BD2.4-L6.3-P10.30-D0.6]  33.4 23.37 90 top
Ri-2  1kΩ  [RES-TH_BD2.4-L6.3-P10.30-D0.6]  30.16 23.3 90 top
Ri-3  1kΩ  [RES-TH_BD2.4-L6.3-P10.30-D0.6]  26.99 23.3 90 top
RL1  10Ω  [RES-TH_BD2.2-L6.5-P10.50-D0.6]  41.28 15.24 180 top
RL2  10Ω  [RES-TH_BD2.2-L6.5-P10.50-D0.6]  41.28 18.16 180 top
RL3  10Ω  [RES-TH_BD2.2-L6.5-P10.50-D0.6]  41.28 21.08 180 top
RLpd1  10kΩ  [RES-TH_BD2.2-L6.5-P10.50-D0.6]  41.28 6.48 0 top
RLpd2  10kΩ  [RES-TH_BD2.2-L6.5-P10.50-D0.6]  41.4 9.4 0 top
RLpd3  10kΩ  [RES-TH_BD2.2-L6.5-P10.50-D0.6]  41.4 12.32 0 top
Rout1  50Ω  [RES-TH_BD2.2-L6.5-P10.50-D0.6]  17.65 35.94 90 top
Rout2  50Ω  [RES-TH_BD2.2-L6.5-P10.50-D0.6]  20.7 35.94 90 top
Rout3  50Ω  [RES-TH_BD2.2-L6.5-P10.50-D0.6]  23.88 35.94 90 top
U1  IR2101PBF  [DIP-8_L9.9-W6.6-P2.54-LS7.62-BL]  53.21 22.48 0 top
U2  IR2101PBF  [DIP-8_L9.9-W6.6-P2.54-LS7.62-BL]  53.21 33.4 0 top
U3  IR2101PBF  [DIP-8_L9.9-W6.6-P2.54-LS7.62-BL]  53.21 44.32 0 top
U4  LM324NG  [PDIP-14_L19.7-W6.6-P2.54-LS8.3-BL]  13.72 52.58 270 top

## Footprints (pads in the part's own frame, mm; a bottom-side part is the same pattern mirrored in y, then rotated)
CAP-TH_BD2.5-L6.6-P9.00-D0.50
  round 1.524 hole 0.914: 1(-4.5,0) 2(4.5,0)
CAP-TH_L3.8-W2.5-P5.08-D0.50
  round 1.4 hole 0.8: 1(-2.54,0) 2(2.54,0)
CONN-TH_2P-P5.08_1733570
  round 2 hole 1.3: 1(-2.54,0) 2(2.54,0)
CONN-TH_3P-P7.62_1717732
  round 2.5 hole 1.6: 1(-7.62,0.01) 2(0,0.01) 3(7.62,-0.01)
DIP-8_L9.9-W6.6-P2.54-LS7.62-BL
  oval 1.524x1.97 hole 0.8: 1(-3.81,-3.81) 2(-1.27,-3.81) 3(1.27,-3.81) 4(3.81,-3.81) 5(3.81,3.81) 6(1.27,3.81) 7(-1.27,3.81) 8(-3.81,3.81)
DO-201AD_BD5.3-L9.5-P13.50-D1.4-RD
  round 2.2 hole 1.4: 1(-6.75,0) 2(6.75,0)
HDR-TH_12P-P2.54-V-M
  rect 1.524x1.524 hole 1.05: 1(-13.97,0)
  round 1.524 hole 1.05: 2(-11.43,0) 3(-8.89,0) 4(-6.35,0) 5(-3.81,0) 6(-1.27,0) 7(1.27,0) 8(3.81,0) 9(6.35,0) 10(8.89,0) 11(11.43,0) 12(13.97,0)
PDIP-14_L19.7-W6.6-P2.54-LS8.3-BL
  rect 1.5x2 hole 1: 1(-7.62,-4)
  oval 1.5x2 hole 1: 2(-5.08,-4) 3(-2.54,-4) 4(0,-4) 5(2.54,-4) 6(5.08,-4) 7(7.62,-4) 8(7.62,4) 9(5.08,4) 10(2.54,4) 11(0,4) 12(-2.54,4) 13(-5.08,4) 14(-7.62,4)
R0603
  rect 0.806x0.864 smd: 1(-0.753,0) 2(0.753,0)
R1206
  rect 1.208x1.701 smd: 1(-1.479,0) 2(1.479,0)
RES-TH_BD2.2-L6.5-P10.50-D0.6
  round 1.6 hole 0.914: 1(-5.25,0) 2(5.25,0)
RES-TH_BD2.4-L6.3-P10.30-D0.6
  round 1.524 hole 1: 1(-5.15,0) 2(5.15,0)
TO-220-3_L10.0-W4.5-P2.54-T
  rect 2.5x2 hole 1.3: 1(0,2.54)
  oval 2.5x2 hole 1.3: 2(0,0) 3(0,-2.54)

## Nets
As in the schematic.

Pads without a net: CN1 4; U4 12 13 14

## Via types
v1: diameter 1.524, hole 0.305, Top Layer to Bottom Layer, 8 vias
v2: diameter 0.61, hole 0.305, Top Layer to Bottom Layer, 90 vias

## Routing (per net, layer and track width the routed paths; a pad name or vN(x,y) marks a point on that pad's centre or on a via; arc(x,y) is an arc through that point)
1.65V: length 43.2
  Top Layer w0.254: v2(1.91,17.78) 1.52,18.16 1.52,30.73 2.54,31.75 2.54,34.16 2.17,34.54 R2.2 ; Rdiv1.1 23.62,17.74 23.75,17.86
  Top Layer w0.762: R2.2 1.45,34.59 R1.1
  Bottom Layer w0.254: Rdiv1.1 1.95,17.74 v2(1.91,17.78)
GND: length 271.5
  Top Layer w0.254: 35.66,9.78 35.77,9.78 RLpd2.1 36.04,9.4 35.66,9.78 ; 35.66,9.78 v2(34.8,9.78) 30.94,13.64 30.94,16.41 v2(30.71,16.64) 30.71,17.61 Ri-2.1 28.19,16.18 v2(26.04,16.18) ; v2(53.37,46.2) 54.26,46.2 v2(54.74,45.72) ; v2(14.86,48.01) 16.44,49.58 16.44,50.46 17.72,51.74 U4.11 ; CN1.5 5.21,41.66 v2(6.73,43.18) ; v2(58.67,43.05) 58.67,42.16 U3.4 ; v2(73.53,40.39) 73.53,41.02 73.1,41.45 73.1,42.97 71.39,44.68 69.88,44.68 CB2.2 ; RLpd1.1 35.26,7.24 v2(34.92,7.24) ; CB2.2 67.55,46.23 66.57,45.25 65.76,45.25 64.78,46.23 CC2.2 ; CB2.2 68.33,51.78 68.33,51.79 68.33,56.12 CN1_12V.2 ; v2(32.94,16.64) 33.4,17.09 Ri-1.1 ; v2(13.08,26.03) 13.08,27.25 ; 13.08,27.25 16.54,27.25 17.65,28.36 18.35,28.36 v2(18.85,27.87) ; 13.08,27.25 11.97,28.36 11.56,28.36 ; v2(59.18,27.94) 59.44,27.69 v2(59.44,23.24) ; v2(9.4,42.29) 10.03,42.29 v2(12.83,45.08) ; v2(26.04,17.4) 26.79,18.15 Ri-3.1
  Top Layer w0.762: v1(74.8,25.27) v1(74.8,22.22)
  Bottom Layer w0.254: v2(18.85,27.87) 19.67,27.87 20.25,27.28 21.15,27.28 21.73,27.87 23.25,27.87 23.75,28.36 ; v2(34.92,7.24) 34.8,7.37 v2(34.8,9.78) 36.15,11.13 RLpd3.1 ; Ri-3.1 24.98,18.15 24.2,18.94 20.17,18.94 v2(13.08,26.03) ; U2.4 57.53,29.59 v2(59.18,27.94) ; RHpd1.1 RHpd2.1 59.35,10.92 60.3,11.87 60.3,12.77 58.91,14.16 58.78,14.16 58.15,14.79 58.15,17.55 U1.4 ; RHpd1.1 56.36,6.48 55.35,5.46 55.35,4.66 55.58,4.43 55.58,3.95 53.33,1.7 51.57,1.7 47.77,5.5 47.77,6.48 47.6,6.65 47.6,6.92 46.97,7.56 46.08,7.56 45,6.48 RLpd1.1 ; RHpd1.1 59.82,6.48 60.95,7.61 67.84,7.61 68.59,8.36 68.59,9.42 67.31,10.7 CN2_7.4-25.2V.2 ; v2(26.04,17.4) v2(26.04,16.18) ; v2(12.83,45.08) 12.83,45.97 v2(14.86,48.01) ; v2(6.73,43.18) 7.62,42.29 v2(9.4,42.29) ; v2(30.71,16.64) v2(32.94,16.64) ; 67.31,14.73 67.31,17.78 CA2.2 61.85,23.24 v2(59.44,23.24) ; RHpd3.1 47,46.2 v2(53.37,46.2) 52.7,46.87 51.51,46.87 50.9,47.48 50.9,50.39 CA1.1 CB1.1 CC1.1 ; v2(73.53,40.39) v2(71.25,40.39) Rcs3.1 ; v2(54.74,45.72) 56.2,45.72 57.35,44.56 57.35,44.37 v2(58.67,43.05) 61.09,45.47 CC2.2
  Bottom Layer w0.762: 74.8,33.53 73.2,31.92 Rcs2.1 ; 74.8,33.53 74.8,28.49 ; 74.8,33.53 74.8,37.21 73.11,38.91 Rcs3.1 ; 74.8,28.49 v1(74.8,25.27) ; 74.8,28.49 Rcs1.1 ; CN2_7.4-25.2V.2 67.31,14.73 v1(74.8,22.22)
VCC_7.4V-25.2V: length 47.1
  Bottom Layer w0.762: CN2_7.4-25.2V.1 67.31,9.27 58.32,18.26 58.32,19.43 55.27,22.48 45.72,22.48 42.29,25.91 QH1.2 QH2.2 QH3.2
VCC_12V: length 230.7
  Top Layer w0.254: v2(48.77,32.05) v2(48.77,33.91) ; v2(54.99,21.34) 57.4,21.34 v2(57.53,21.46) ; v2(50.67,37.97) v2(50.67,39.94)
  Bottom Layer w0.254: v2(54.99,21.34) 53.59,19.93 51.51,19.93 50.25,18.67 U1.1 ; 50.1,40.51 50.25,40.51 52.01,42.27 69.45,42.27 CB2.1 ; 50.1,40.51 v2(50.67,39.94) ; 50.1,40.51 U3.1 ; v2(50.67,37.97) 50.44,37.74 50.44,36.56 49.83,35.95 48.97,35.95 48.77,35.74 v2(48.77,33.91) ; CB2.1 69.71,46.23 68.73,47.21 67.92,47.21 66.94,46.23 CC2.1 67.06,47.12 CN1_12V.1 65.33,52.32 CC1.2 CB1.2 CA1.2 57.33,49.4 56.59,49.4 55.98,48.79 55.98,48.05 55.52,47.59 55.52,47.48 52.01,43.96 51.48,43.96 51.12,44.32 35.83,44.32 D1.2 D2.2 D3.2 28.09,52.58 22.12,52.58 21,53.7 17.14,53.7 16.01,52.58 U4.4 ; CB2.1 75.84,43.79 75.84,24.79 72.52,21.46 CA2.1 ; v2(57.53,21.46) 57.53,22.61 59.3,24.38 67.33,24.38 68.25,25.3 69.51,25.3 71.23,27.01 72.21,27.01 72.38,27.18 72.38,27.84 73.16,28.63 73.65,28.63 73.99,28.97 73.99,30.34 73.48,30.85 54.05,30.85 53.44,30.24 53.44,28.94 52.33,27.82 51.17,27.82 U2.1 49.4,31.42 v2(48.77,32.05)
PA8: length 92.4
  Top Layer w0.254: v2(51.05,17.27) 51.94,18.16 U1.2 ; v2(51.82,2.29) 51.55,2.55 34.39,2.55 27.68,9.26 27.68,10.8 23.63,14.86 7.34,14.86 2.49,19.71 2.49,24.9 2.84,25.25 2.84,27.29 3.2,27.65 3.2,29.68 3.56,30.04 3.56,32.07 3.91,32.43 3.91,34.47 4.95,35.51 CN1.7
  Bottom Layer w0.254: v2(51.82,2.29) 51.82,16.51 v2(51.05,17.27)
PA9: length 129.4
  Top Layer w0.254: CN1.9 4.95,30.43 3.91,29.39 3.91,27.35 3.56,26.99 3.56,24.96 3.2,24.6 3.2,20.01 7.62,15.59 26.4,15.59 33.67,8.32 36.6,8.32 41.66,3.26 52.9,3.26 57.25,7.61 60.09,7.61 61.14,8.66 61.14,10.7 61.73,11.28 61.73,11.59 73.44,23.31 73.44,23.8 73.46,23.81 73.46,28.5 73.58,28.63 73.65,28.63 73.99,28.97 73.99,29.45 73.41,30.04 v2(73.41,30.1) ; v2(60.66,30.1) 58.17,30.1 58.06,30.2 58.06,30.24 57.45,30.85 57.41,30.85 v2(56.64,31.62) ; v2(54.86,31.62) 54.1,30.85 54.05,30.85 53.44,30.24 53.44,30.2 52.83,29.59 U2.2 ; v2(71.76,30.1) v2(62.36,30.1)
  Bottom Layer w0.254: v2(73.41,30.1) v2(71.76,30.1) ; v2(54.86,31.62) v2(56.64,31.62) ; v2(62.36,30.1) v2(60.66,30.1)
PA10: length 141.5
  Top Layer w0.254: v2(56.77,44.32) 71.24,44.32 72.75,42.82 72.75,24.11 72.73,24.1 72.73,23.6 61.02,11.88 61.02,11.58 60.43,10.99 60.43,8.95 59.8,8.32 56.95,8.32 52.61,3.97 44.22,3.97 37.31,10.88 35.56,10.88 34.72,11.72 34.72,13.01 31.65,16.08 31.65,18.65 29.98,20.31 27.33,20.31 25.18,18.16 25.18,17.27 24.22,16.3 7.91,16.3 3.91,20.3 3.91,24.31 4.95,25.35 CN1.11 ; v2(51.94,43.18) U3.2
  Bottom Layer w0.254: v2(56.77,44.32) 56.34,43.89 54.62,43.89 53.91,43.18 v2(51.94,43.18)
PB13: length 90.7
  Top Layer w0.254: U1.3 54.48,17.78 v2(53.85,17.14) ; CN1.8 4.95,32.97 3.91,31.93 3.91,29.89 3.56,29.53 3.56,27.5 3.2,27.14 3.2,25.11 2.84,24.75 2.84,19.86 7.47,15.23 23.76,15.23 27.56,11.42 29.84,11.42 30.74,10.53 30.74,9.26 37.1,2.91 53.05,2.91 54.33,4.19 v2(54.99,4.19)
  Bottom Layer w0.254: v2(53.85,17.14) 54.99,16 v2(54.99,4.19)
PB14: length 128.1
  Top Layer w0.254: v2(73.41,29.21) 73.1,28.91 73.1,23.96 73.09,23.95 73.09,23.45 61.37,11.74 61.37,11.43 60.79,10.84 60.79,8.8 59.95,7.96 57.1,7.96 52.75,3.62 44.08,3.62 37.17,10.53 35.41,10.53 34.36,11.58 34.36,12.86 31.29,15.93 31.29,18.5 29.83,19.96 29.4,19.96 28.03,18.59 28.03,17.72 27.07,16.76 25.27,16.76 24.45,15.95 7.77,15.95 3.56,20.16 3.56,24.45 3.91,24.81 3.91,26.85 4.95,27.89 CN1.10 ; U2.3 54.48,28.49 v2(54.9,28.07) ; v2(60.74,29.34) 58.55,29.34 57.28,28.07 v2(56.64,28.07) ; v2(62.36,29.34) 62.48,29.21 v2(71.76,29.21)
  Bottom Layer w0.254: v2(73.41,29.21) v2(71.76,29.21) ; v2(62.36,29.34) v2(60.74,29.34) ; v2(56.64,28.07) v2(54.9,28.07)
PB15: length 132.8
  Top Layer w0.254: v2(56.77,43.24) 57.35,43.81 71.25,43.81 72.39,42.67 72.39,24.26 72.38,24.24 72.38,23.75 69.11,20.48 68.62,20.48 67.31,19.18 67.31,19.18 60.66,12.53 60.66,11.72 59.82,10.88 59.01,10.88 52.46,4.33 44.37,4.33 37.46,11.24 35.7,11.24 35.07,11.87 35.07,12.77 35.14,12.83 35.14,13.09 32,16.22 32,18.8 30.13,20.67 27.19,20.67 24.83,18.31 24.83,17.42 24.07,16.66 8.06,16.66 7.43,17.29 7.43,21.4 CN1.12 ; v2(54.86,43.31) 54.86,40.89 U3.3
  Bottom Layer w0.254: v2(54.86,43.31) 56.7,43.31 v2(56.77,43.24)
PC0: length 15.2
  Top Layer w0.254: CN1.3 8.77,46.74 9.04,46.47 10.39,46.47 10.66,46.74 12.11,46.74 Rout1.2
PC1: length 19.1
  Top Layer w0.254: Rout2.2 18.32,43.57 15.83,43.57 10.39,49.01 9.04,49.01 8.77,49.28 CN1.2
PC2: length 23.8
  Top Layer w0.254: Rout3.2 21.14,43.93 17.04,43.93 16.44,44.53 16.44,45.38 10.27,51.55 9.04,51.55 8.77,51.82 CN1.1
PHASE_A: length 110.6
  Top Layer w0.254: QH1.3 46.48,27.69 53.09,27.69 54.48,26.29 54.86,26.29 55.52,26.95 55.52,48.79 54.56,49.75 49.62,49.75 Cbl1.2
  Top Layer w0.762: v1(43.12,23.18) 45.14,23.18 v1(45.99,24.03)
  Bottom Layer w0.762: CN3_MOTOR1.1 19.07,9.92 20.87,8.11 29.95,8.11 30.99,9.16 30.99,10.46 34.44,13.91 36.58,13.91 37.36,14.69 37.36,16.39 38.95,17.98 38.95,19.02 v1(43.12,23.18) ; QL1.2 63.26,26.91 63.26,27.38 62.94,27.69 60.5,27.69 57.58,24.77 48.87,24.77 47.73,25.91 QH1.3 44.7,25.32 v1(45.99,24.03)
PHASE_B: length 97.1
  Top Layer w0.254: Cbl2.2 43.94,52.9 v2(43.94,49.68) ; v2(50.89,45.37) 49.4,46.87 48.97,46.87 48.25,47.59 46.06,47.59 45.33,48.31 v2(43.94,48.31) ; v2(51.72,44.54) 53.44,42.82 53.44,39.86 54.48,38.82 U2.6 51.99,34.72 46.53,34.72 QH2.3
  Top Layer w0.762: v1(36.7,29.84) v1(43.56,29.84)
  Bottom Layer w0.254: v2(43.94,48.31) v2(43.94,49.68) ; v2(50.89,45.37) v2(51.72,44.54)
  Bottom Layer w0.762: CN3_MOTOR1.2 28.87,17.19 28.87,18.69 29.63,19.45 31.12,19.45 36.7,25.03 v1(36.7,29.84) ; QL2.2 63.26,33.9 63.26,34.36 62.94,34.68 60.5,34.68 58.72,32.89 QH2.3 44.7,30.99 v1(43.56,29.84)
PHASE_C: length 89
  Top Layer w0.254: QH3.3 48.39,43.56 49.91,43.56 U3.6 54.23,48.13 v2(53.34,49.02) ; Cbl3.2 46.92,57.61 48.09,56.44 48.09,55.42 49.68,53.82 49.94,53.82 v2(53.34,50.42)
  Top Layer w0.762: v1(43.82,36.98) v1(40.56,36.98)
  Bottom Layer w0.254: v2(53.34,50.42) v2(53.34,49.02)
  Bottom Layer w0.762: 29.21,9.9 34.69,15.38 34.69,15.79 35.73,16.83 36.58,16.83 38.09,18.34 38.09,34.52 v1(40.56,36.98) ; v1(43.82,36.98) 44.7,37.87 QH3.3 47.98,39.88 48.87,38.99 57.83,38.99 60.5,41.66 62.94,41.66 63.26,41.35 63.26,40.88 QL3.2
STM_3V3: length 3.5
  Top Layer w0.762: CN1.6 4.93,39.09 R1.2
$1N901: length 20.7
  Top Layer w0.254: RH1.1 50.17,13.76 v2(50.17,13.84) ; 51.94,26.29 48.11,22.45 48.11,21.14 46.21,19.24 46.08,19.24 45.45,18.61 45.45,17.71 46.08,17.08 46.29,17.08 v2(46.61,16.76)
  Bottom Layer w0.254: v2(50.17,13.84) 49.85,14.16 48.28,14.16 47.65,14.79 47.65,16.36 47.24,16.76 v2(46.61,16.76)
$1N905: length 16.1
  Top Layer w0.254: RL1.1 48.69,17.4 49.83,17.4 50.44,18.01 50.44,19.16 57.02,25.74 57.02,26.29
$1N1407: length 44.3
  Top Layer w0.254: QH1.1 36.74,23.03 36.44,23.03 34.95,21.53 34.95,14.79 35.58,14.16 37.32,14.16 46.08,5.4 46.97,5.4 48.05,6.48 RHpd1.2 53.38,6.48 RH1.2
$1N1412: length 41.1
  Top Layer w0.254: RL1.2 37.76,15.24 RLpd1.2 47.77,7.72 47.77,9.84 48.41,10.48 50.53,10.48 61.72,21.67 61.72,25.91
$1N2797: length 63.5
  Top Layer w0.254: v2(48.51,27.1) 48.59,27.1 49.4,26.29 ; v2(47.75,33.91) 47.75,30.99 v2(47.12,30.35) ; v2(47.75,37.25) 46.65,38.35 38.51,38.35 31.52,45.34 21.32,45.34 D1.1 31.95,46.23 35.07,49.35 35.07,49.47 35.7,50.1 35.82,50.1 Cbl1.1
  Bottom Layer w0.254: v2(47.12,30.35) 48.36,29.11 48.36,28.94 48.51,28.78 v2(48.51,27.1) ; v2(47.75,33.91) v2(47.75,37.25)
$1N3429: length 30.4
  Top Layer w0.254: v2(51.94,35.56) U2.7 ; RH2.1 49.15,15.66 v2(49.15,16.64) ; v2(45.47,19.81) 45.47,20.61 45.45,20.63 45.45,21.94 47.22,23.72 47.22,26.57 v2(46.74,27.05) ; v2(53.85,35.56) 49.5,31.21 48.82,31.21 46.74,29.12 v2(46.74,28.27)
  Bottom Layer w0.254: v2(49.15,16.64) 47.6,18.18 47.6,18.61 46.97,19.24 46.55,19.24 45.97,19.81 v2(45.47,19.81) ; v2(53.85,35.56) v2(51.94,35.56) ; v2(46.74,27.05) v2(46.74,28.27)
$1N3432: length 24.3
  Top Layer w0.254: U2.5 57.07,37.16 57.07,33.45 55.98,32.36 55.98,26.09 54.56,24.67 53.03,24.67 RL2.1
$1N3435: length 58
  Top Layer w0.254: RH2.2 53.38,9.4 49.28,9.4 ; 49.28,9.4 49.28,8.38 v2(50.29,7.37) ; 49.28,9.4 RHpd2.2 ; v2(50.26,5.58) 49.48,5.58 49.3,5.4 47.48,5.4 47.12,5.04 45.93,5.04 37.17,13.8 35.43,13.8 34.59,14.65 34.59,21.68 35.66,22.75 35.66,30.28 36.7,31.32 38.05,31.32 QH2.1
  Bottom Layer w0.254: v2(50.29,7.37) 50.29,5.61 v2(50.26,5.58)
$1N3439: length 44.7
  Top Layer w0.254: RL2.2 37.89,18.16 RLpd2.2 48.49,11.24 49.17,11.24 55.98,18.05 55.98,19.32 56.59,19.93 57.19,19.93 60.44,23.19 60.44,27.27 61.72,28.55 61.72,32.89
$1N3456: length 44.5
  Top Layer w0.254: v2(47.75,42.04) 48.36,41.43 48.36,39.86 49.4,38.82 U2.8 ; D2.1 31.98,52.32 33.36,53.7 35.74,53.7 Cbl2.1 41.78,52.27 v2(41.78,49.75) ; v2(46.99,43.18) 44.96,45.21 v2(41.78,45.21)
  Bottom Layer w0.254: v2(46.99,43.18) 47.75,42.42 v2(47.75,42.04) ; v2(41.78,45.21) v2(41.78,49.75)
$1N3955: length 17.4
  Top Layer w0.254: U3.7 51.05,49.02 50.21,49.02 49.83,49.4 48.55,49.4 47.1,47.94 46.2,47.94 45.13,49.02 RH3.1
$1N3958: length 33.1
  Top Layer w0.254: v2(54.86,35.4) 50.32,30.85 48.97,30.85 48.36,30.24 48.36,28.9 v2(47.75,28.29) ; RL3.1 47.75,22.31 v2(47.75,27.05) ; U3.5 56.15,47.26 56.15,41.33 55.98,41.17 55.98,36.56 56.15,36.39 v2(56.15,35.4)
  Bottom Layer w0.254: v2(54.86,35.4) v2(56.15,35.4) ; v2(47.75,27.05) v2(47.75,28.29)
$1N3961: length 21
  Top Layer w0.254: v2(45.08,47.64) 43.42,45.97 RHpd3.2 39.62,42.63 QH3.1 ; v2(45.13,49.77) 45.91,49.77 RH3.2
  Bottom Layer w0.254: v2(45.13,49.77) 45.08,49.73 v2(45.08,47.64)
$1N3965: length 50.8
  Top Layer w0.254: 61.72,39.88 61.72,35.54 60.44,34.26 60.44,31.53 61.37,30.6 61.37,28.85 61.08,28.85 60.98,28.75 60.5,28.75 60.4,28.85 58.83,28.85 58.29,28.32 58.29,25.78 53.44,20.93 53.44,18.43 49.17,14.16 48.49,14.16 RLpd3.2 37.89,21.08 RL3.2
$1N3982: length 38
  Top Layer w0.254: v2(48.19,48.21) 49.33,48.21 U3.8 ; v2(47.88,49.66) 46.61,50.93 v2(44.53,50.93) ; v2(43.36,50.93) 43.36,54.25 Cbl3.1 36.65,58.42 35.88,58.42 34.5,59.8 33.36,59.8 31.98,58.42 D3.1
  Bottom Layer w0.254: v2(47.88,49.66) 48.19,49.35 v2(48.19,48.21) ; v2(43.36,50.93) v2(44.53,50.93)
$1N9537: length 56.9
  Bottom Layer w0.254: Ri-1.2 31.7,28.52 29.47,26.29 15.75,26.29 15.42,26.62 11.78,26.62 10.48,27.92 10.48,28.72 Rf1.1 9.72,31.89 9.72,41.78 9.98,42.05 9.98,42.53 8.44,44.08 8.44,55.54 9.72,56.82 U4.2
$1N9581: length 41.7
  Top Layer w0.254: v2(7.44,46.04) 7.44,40.74 11.56,36.62 Rf2.1 ; U4.6 9.7,47.48 v2(7.44,47.48)
  Bottom Layer w0.254: Rf2.1 12.81,29.44 15.05,29.44 16.57,27.92 16.57,27.92 17.69,26.8 26.8,26.8 28.46,28.45 Ri-2.2 ; v2(7.44,46.04) v2(7.44,47.48)
$1N9815: length 33.4
  Bottom Layer w0.254: Ri-3.2 25.83,29.61 17.21,29.61 16.13,30.69 Rf3.1 17.72,33.8 17.72,39.6 16.57,40.74 16.57,41.64 19,44.06 19,45.38 17.72,46.66 U4.9
$1N9932: length 72.6
  Top Layer w0.254: U4.3 16.01,55.12 17.39,53.74 18.87,53.74 19.05,53.56 19.05,45.66 19.86,44.85 29.39,44.85 Ri+1.2
  Bottom Layer w0.254: U4.3 9.72,56.32 10.03,56.63 10.39,56.63 11,57.23 11,58.08 10.39,58.69 9.04,58.69 6.15,55.79 6.15,31.53 8.51,29.16 Rdiv1.2
$1N9983: length 60.6
  Top Layer w0.254: Ri+2.2 25.31,36.18 25.31,28.4 24.2,27.28 20.25,27.28 19.62,27.92 19.62,27.92 18.1,29.44 17.21,29.44 16.13,28.36 Rdiv3.1 13.36,29.61 11.11,29.61 10.48,30.24 10.48,31.14 8.87,32.75 8.87,36.68 5.38,40.16 4.98,40.16 3.91,41.22 3.91,49.71 4.52,50.32 5.38,50.32 5.66,50.04 U4.5
$1N9988: length 46.7
  Top Layer w0.254: v2(61.09,36.32) 58.8,34.04 v2(57.66,34.04) ; v2(62.38,36.32) 63.37,36.32 QL2.3 ; v2(49.53,35.31) 34.74,35.31 Ri+2.1
  Bottom Layer w0.254: v2(61.09,36.32) v2(62.38,36.32) ; v2(49.53,35.31) 50.36,35.31 51.22,34.44 56.87,34.44 57.28,34.04 v2(57.66,34.04)
  Bottom Layer w0.762: Rcs2.2 69.26,32.89 QL2.3
$1N10075: length 30.5
  Top Layer w0.254: Ri+3.2 24.95,38.99 24.95,30.24 24.32,29.61 23.43,29.61 22.8,30.24 22.58,30.24 Rdiv5.1
  Bottom Layer w0.254: U4.10 17.98,50.04 20.41,47.61 21,47.61 21.81,46.8 21.81,46.21 Ri+3.2
$1N10080: length 53.2
  Top Layer w0.254: v2(50.93,35.56) 50.55,35.94 33.9,35.94 28.69,30.73 Ri+3.1 ; QL3.3 66.32,39.88 64.79,41.41 60.61,41.41 58.93,39.73 58.93,36.07 v2(57.66,34.8)
  Bottom Layer w0.254: v2(57.66,34.8) 51.69,34.8 v2(50.93,35.56)
  Bottom Layer w0.762: Rcs3.2 69.26,39.88 QL3.3
$1N10124: length 39.6
  Top Layer w0.254: v2(14.22,48.51) 11,51.74 11,53 9.91,54.09 9.04,54.09 8.44,54.69 8.44,58.08 9.72,59.36 U4.1 ; v2(11.94,45.97) 11.94,44.96 10.03,43.05 9.16,43.05 8.51,42.41 Rf1.2 17.65,32.05 Rout1.1
  Bottom Layer w0.254: v2(11.94,45.97) 14.22,48.26 v2(14.22,48.51)
$1N10167: length 18.8
  Top Layer w0.254: Rout2.1 20.7,32.05 Rf2.2
  Bottom Layer w0.254: U4.7 11.56,43.12 Rf2.2
$1N10257: length 19.4
  Top Layer w0.254: Rout3.1 23.88,31.92 Rf3.2
  Bottom Layer w0.254: Rf3.2 17.72,44.3 U4.8
$1N11031: length 74.4
  Top Layer w0.254: QL1.3 66.8,19.18 60.3,12.68 60.3,11.87 59.67,11.24 58.86,11.24 58.67,11.05 58.46,11.05 53.53,6.12 51.14,6.12 50.84,5.82 50.84,5.34 50.5,4.99 47.57,4.99 47.27,4.69 45.78,4.69 37.02,13.45 35.28,13.45 32.36,16.37 32.36,18.65 34.23,20.52 34.23,21.82 35.31,22.9 35.31,28.63 Ri+1.1
  Bottom Layer w0.762: QL1.3 69.26,25.91 Rcs1.2

## Copper pours and planes (outline as drawn; the poured copper is in the pictures)
GND on Top Layer: -9.91,70.48 87.38,70.48 87.38,-5.72 -9.91,-5.72
GND on Bottom Layer: -39.88,78.1 120.9,78.1 120.9,-22.73 -39.88,-22.73
